# Altium schematic sheet blackfin_f_power.SchDoc: Power
size A3; SheetNumber: 6; SheetTotal: 6
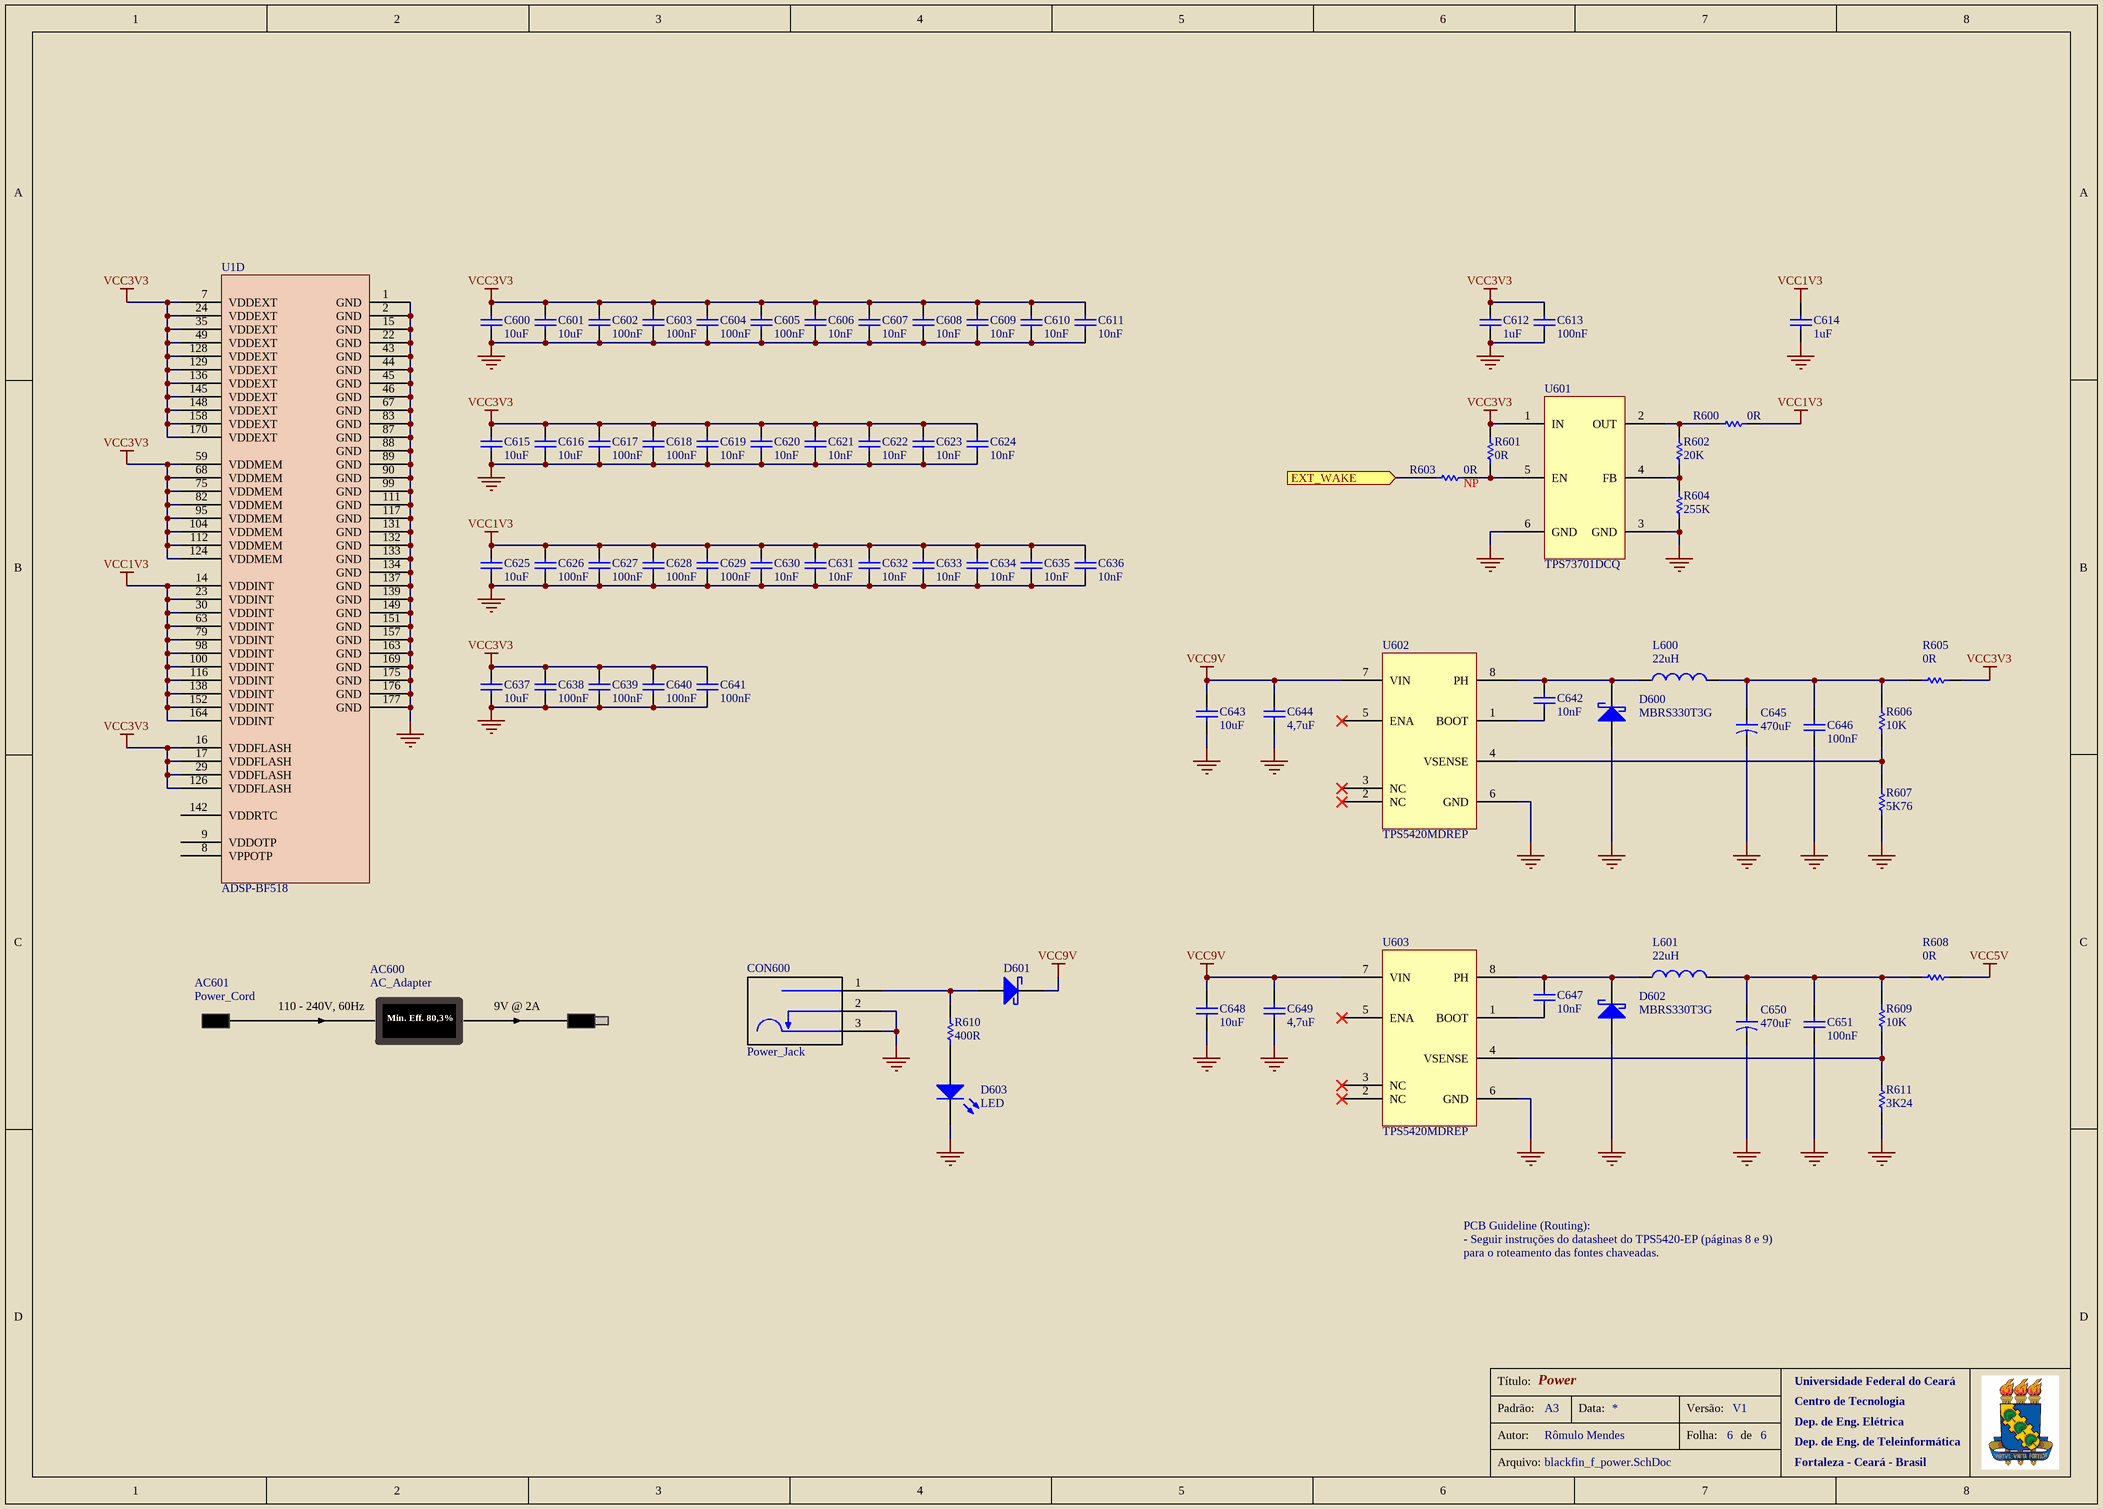
[diagram p0: blackfin_f_power.SchDoc]

## Parts
AC600  AC_Adapter  (mechanical)
AC601  Power_Cord  (mechanical)
C600  10uF  [C_0805]
C601  10uF  [C_0805]
C602  100nF  [C_0603]
C603  100nF  [C_0603]
C604  100nF  [C_0603]
C605  100nF  [C_0603]
C606  10nF  [C_0603]
C607  10nF  [C_0603]
C608  10nF  [C_0603]
C609  10nF  [C_0603]
C610  10nF  [C_0603]
C611  10nF  [C_0603]
C612  1uF  [C_0603]
C613  100nF  [C_0603]
C614  1uF  [C_0603]
C615  10uF  [C_0805]
C616  10uF  [C_0805]
C617  100nF  [C_0603]
C618  100nF  [C_0603]
C619  10nF  [C_0603]
C620  10nF  [C_0603]
C621  10nF  [C_0603]
C622  10nF  [C_0603]
C623  10nF  [C_0603]
C624  10nF  [C_0603]
C625  10uF  [C_0805]
C626  100nF  [C_0603]
C627  100nF  [C_0603]
C628  100nF  [C_0603]
C629  100nF  [C_0603]
C630  10nF  [C_0603]
C631  10nF  [C_0603]
C632  10nF  [C_0603]
C633  10nF  [C_0603]
C634  10nF  [C_0603]
C635  10nF  [C_0603]
C636  10nF  [C_0603]
C637  10uF  [C_0805]
C638  100nF  [C_0603]
C639  100nF  [C_0603]
C640  100nF  [C_0603]
C641  100nF  [C_0603]
C642  10nF  [C_0805]
C643  10uF  [C_0805]
C644  4,7uF  [C_0805]
C645  470uF  [C_Case_Y]
C646  100nF  [C_0603]
C647  10nF  [C_0805]
C648  10uF  [C_0805]
C649  4,7uF  [C_0805]
C650  470uF  [C_Case_Y]
C651  100nF  [C_0603]
CON600  Power_Jack  [Power_Jack]
D600  MBRS330T3G  [Case_430]
D601  Schottky_Diode  [Case_430]  (value not drawn)
D602  MBRS330T3G  [Case_430]
D603  LED  [LED_0603]
L600  22uH  [Inductor_22uH]
L601  22uH  [Inductor_22uH]
R600  0R  [R_0603]
R601  0R  [R_0603]
R602  20K  [R_0603]
R603  0R  [R_0603]
R604  255K  [R_0603]
R605  0R  [R_2512]
R606  10K  [R_0603]
R607  5K76  [R_0603]
R608  0R  [R_2512]
R609  10K  [R_0603]
R610  400R  [R_1206]
R611  3K24  [R_0603]
U1  ADSP-BF518  [LQFP-176]  (part D of 4)
U601  TPS73701DCQ  [SOT-223]
U602  TPS5420MDREP  [SOIC-8 (TPS5420MDREP)]
U603  TPS5420MDREP  [SOIC-8 (TPS5420MDREP)]

## Ports
EXT_WAKE (in)

## Nets
GND: C600.1 C601.1 C602.1 C603.1 C604.1 C605.1 C606.1 C607.1 C608.1 C609.1 C610.1 C611.1 C612.1 C613.1 C614.1 C615.1 C616.1 C617.1 C618.1 C619.1 C620.1 C621.1 C622.1 C623.1 C624.1 C625.1 C626.1 C627.1 C628.1 C629.1 C630.1 C631.1 C632.1 C633.1 C634.1 C635.1 C636.1 C637.1 C638.1 C639.1 C640.1 C641.1 C643.1 C644.1 C645.2 C646.1 C648.1 C649.1 C650.2 C651.1 CON600.2 CON600.3 D600.1(A) D602.1(A) D603.2(K) R604.1 R607.1 R611.1 U1.1(GND) U1.2(GND) U1.15(GND) U1.22(GND) U1.43(GND) U1.44(GND) U1.45(GND) U1.46(GND) U1.67(GND) U1.83(GND) U1.87(GND) U1.88(GND) U1.89(GND) U1.90(GND) U1.99(GND) U1.111(GND) U1.117(GND) U1.131(GND) U1.132(GND) U1.133(GND) U1.134(GND) U1.137(GND) U1.139(GND) U1.149(GND) U1.151(GND) U1.157(GND) U1.163(GND) U1.169(GND) U1.175(GND) U1.176(GND) U1.177(GND) U601.3(GND) U601.6(GND) U602.6(GND) U603.6(GND)
VCC1V3: C614.2 C625.2 C626.2 C627.2 C628.2 C629.2 C630.2 C631.2 C632.2 C633.2 C634.2 C635.2 C636.2 R600.2 U1.14(VDDINT) U1.23(VDDINT) U1.30(VDDINT) U1.63(VDDINT) U1.79(VDDINT) U1.98(VDDINT) U1.100(VDDINT) U1.116(VDDINT) U1.138(VDDINT) U1.152(VDDINT) U1.164(VDDINT)
VCC3V3: C600.2 C601.2 C602.2 C603.2 C604.2 C605.2 C606.2 C607.2 C608.2 C609.2 C610.2 C611.2 C612.2 C613.2 C615.2 C616.2 C617.2 C618.2 C619.2 C620.2 C621.2 C622.2 C623.2 C624.2 C637.2 C638.2 C639.2 C640.2 C641.2 R601.2 R605.2 U1.7(VDDEXT) U1.16(VDDFLASH) U1.17(VDDFLASH) U1.24(VDDEXT) U1.29(VDDFLASH) U1.35(VDDEXT) U1.49(VDDEXT) U1.59(VDDMEM) U1.68(VDDMEM) U1.75(VDDMEM) U1.82(VDDMEM) U1.95(VDDMEM) U1.104(VDDMEM) U1.112(VDDMEM) U1.124(VDDMEM) U1.126(VDDFLASH) U1.128(VDDEXT) U1.129(VDDEXT) U1.136(VDDEXT) U1.145(VDDEXT) U1.148(VDDEXT) U1.158(VDDEXT) U1.170(VDDEXT) U601.1(IN)
VCC5V: R608.2
VCC9V: C643.2 C644.2 C648.2 C649.2 D601.2(K) U602.7(VIN) U603.7(VIN)
EXT_WAKE: R603.1 ; port EXT_WAKE
NetC642_1: C642.1 U602.1(BOOT)
NetC642_2: C642.2 D600.2(K) L600.1 U602.8(PH)
NetC645_1: C645.1 C646.2 L600.2 R605.1 R606.2
NetC647_1: C647.1 U603.1(BOOT)
NetC647_2: C647.2 D602.2(K) L601.1 U603.8(PH)
NetC650_1: C650.1 C651.2 L601.2 R608.1 R609.2
NetCON600_1: CON600.1 D601.1(A) R610.2
NetD603_1: D603.1(A) R610.1
NetR600_1: R600.1 R602.2 U601.2(OUT)
NetR601_1: R601.1 R603.2 U601.5(EN)
NetR602_1: R602.1 R604.2 U601.4(FB)
NetR606_1: R606.1 R607.2 U602.4(VSENSE)
NetR609_1: R609.1 R611.2 U603.4(VSENSE)

Not connected (* = marked no-connect by the designer): U1 8(VPPOTP) 9(VDDOTP) 142(VDDRTC); U602 2(NC)* 3(NC)* 5(ENA)*; U603 2(NC)* 3(NC)* 5(ENA)*

## Notes on the sheet
- (near R603) NP
- PCB Guideline (Routing):
- - Seguir instruções do datasheet do TPS5420-EP (páginas 8 e 9)
- para o roteamento das fontes chaveadas.
- Título:
- Universidade Federal do Ceará
- Padrão:
- Autor:
- A3
- Rômulo Mendes
- Data:
- Versão:
- Folha:
- V1
- de
- Centro de Tecnologia
- Dep. de Eng. Elétrica
- Dep. de Eng. de Teleinformática
- Arquivo:
- Fortaleza - Ceará - Brasil
- (in symbol AC_Adapter) 110 - 240V, 60Hz; 9V @ 2A; Min. Eff. 80,3%

## Library data of the parts
AC600 = AC_Adapter: eVendorPart#: 552-PSA-A18U-090; Part#: PSAA18U-090-R; Manufacturer: Phihong; eVendor: Mouser; eVendorPrice: 17,73; MSRP: 14,27; MOQ: 1000
AC601 = Power_Cord: eVendorPart#: 693-6009.1315; Part#: 6009.1315; Manufacturer: Schurter; eVendor: Mouser; eVendorPrice: 6,74; MSRP: 4,77; MOQ: 1000
C600 C601 C615 C616 C625 C637 = Capacitor: eVendorPart#: 810-C2012Y5V1C106Z; Manufacturer: TDK; Part#: C2012Y5V1C106Z; eVendor: Mouser; eVendorPrice: 0,10; MSRP: 0,05; MOQ: 1000
C602-C605 C613 C617 C618 C626-C629 C638-C641 C646 C651 = Capacitor: eVendorPart#: 81-GRM188R71E104KA01; Manufacturer: Murata; Part#: GRM188R71E104KA01J; eVendor: Mouser; eVendorPrice: 0,14; MSRP: 0,11; MOQ: 1000
C606-C611 C619-C624 C630-C636 = Capacitor: eVendorPart#: 77-VJ0603Y103KXAPBC; Manufacturer: Vishay/Vitramon; Part#: VJ0603Y103KXAPW1BC; eVendor: Mouser; eVendorPrice: 0,05; MSRP: 0,013; MOQ: 1000
C612 C614 = Capacitor: eVendorPart#: 81-GRM188F51E105ZA12; Manufacturer: Murata; Part#: GRM188F51E105ZA12D; eVendor: Mouser; eVendorPrice: 0,07; MSRP: 0,016; MOQ: 1000
C642 C647 = Capacitor: eVendorPart#: 81-GRM216R71H103JA1D; Manufacturer: Murata; Part#: GRM216R71H103JA01D; eVendor: Mouser; eVendorPrice: 0,23; MSRP: 0,026; MOQ: 1000
C643 C648 = Capacitor: eVendorPart#: 810-C2012X5R1C106M; Manufacturer: TDK; Part#: C2012X5R1C106M; eVendor: Mouser; eVendorPrice: 0,16; MSRP: 0,098; MOQ: 1000
C644 C649 = Capacitor: eVendorPart#: 81-GRM21BR61C475KA8L; Manufacturer: Murata; Part#: GRM21BR61C475KA88L; eVendor: Mouser; eVendorPrice: 0,42; MSRP: 0,076; MOQ: 1000
C645 C650 = Capacitor_Pol: eVendorPart#: 80-T520Y477M6ATE15; Part#: T520Y477M006ATE015; Manufacturer: Kemet; eVendor: Mouser; eVendorPrice: 3,27; MSRP: 1,92; MOQ: 1000
CON600 = Power_Jack: eVendorPart#: 163-179PH-EX; Manufacturer: Kobiconn; eVendor: Mouser; MSRP: 0,51; eVendorPrice: 0,87; MOQ: 1000; Part#: 163-179PH-EX
D600 D602 = Schottky_Diode: eVendorPart#: 863-MBRS330T3G; Manufacturer: ON Semiconductor; eVendorPrice: 0,37; MSRP: 0,17; eVendor: Mouser; Part#: MBRS330T3G; MOQ: 1000
D601 = Schottky_Diode: eVendorPart#: 863-MBRS330T3G; Part#: MBRS330T3G; Manufacturer: ON Semiconductor; eVendorPrice: 0,37; MSRP: 0,17; eVendor: Mouser; MOQ: 1000
D603 = LED: Red LED; eVendorPart#: 638-QTLP600C2TR; Manufacturer: Everlight; Part#: QTLP600C2TR; eVendor: Mouser; eVendorPrice: 0,22; MSRP: 0,083; MOQ: 1000
L600 L601 = Inductor: eVendorPart#: 710-744066220; Manufacturer: Wurth Electronics; Part#: 744066220; eVendor: Mouser; eVendorPrice: 2,88; MSRP: 0,95; MOQ: 1000
R600 R601 R603 = Resistor: eVendorPart#: 71-CRCW06030000Z0EB; Part#: CRCW06030000Z0EB; Manufacturer: Vishay/Dale; eVendor: Mouser; eVendorPrice: 0,06; MSRP: 0,015; MOQ: 1000
R602 = Resistor: eVendorPart#: 71-CRCW0603J-20K-E3; Part#: CRCW060320K0JNEA; Manufacturer: Vishay/Dale; eVendor: Mouser; eVendorPrice: 0,06; MSRP: 0,01; MOQ: 1000
R604 = Resistor: eVendorPart#: 71-CRCW0603-255K-E3; Part#: CRCW0603255KFKEA; Manufacturer: Vishay/Dale; eVendor: Mouser; eVendorPrice: 0,06; MSRP: 0,015; MOQ: 1000
R605 R608 = Resistor: eVendorPart#: 71-CRCW2512-0-E3; Part#: CRCW25120000Z0EG; Manufacturer: Vishay/Dale; eVendor: Mouser; eVendorPrice: 0,14; MSRP: 0,05; MOQ: 1000
R606 R609 = Resistor: eVendorPart#: 71-CRCW0603-10K-E3; Part#: CRCW060310K0FKEA; Manufacturer: Vishay/Dale; eVendor: Mouser; eVendorPrice: 0,06; MSRP: 0,015; MOQ: 1000
R607 = Resistor: eVendorPart#: 660-RK73H1JTTDD5761F; Part#: RK73H1JTTDD5761F; Manufacturer: KOA Speer; eVendor: Mouser; eVendorPrice: 0,08; MSRP: 0,015; MOQ: 1000
R610 = Resistor: eVendorPart#: 71-CRCW1206390RJNEB; Part#: CRCW1206390RJNEB; Manufacturer: Vishay/Dale; eVendor: Mouser; eVendorPrice: 0,10; MSRP: 0,02; MOQ: 1000
R611 = Resistor: eVendorPart#: 71-CRCW0603-3.24K-E3; Part#: CRCW06033K24FKEA; Manufacturer: Vishay/Dale; eVendor: Mouser; eVendorPrice: 0,06; MSRP: 0,015; MOQ: 1000
U1 = ADSP-BF518: eVendorPart#: ADSP-BF518BSWZ-4; eVendor: Analog Devices; eVendorPrice: 13,76; MSRP: 13,07; Part#: ADSP-BF518BSWZ-4; Manufacturer: Analog Devices; MOQ: 1000
U601 = TPS73701DCQ: eVendorPart#: 595-TPS73701DCQ; Manufacturer: Texas Instruments; eVendor: Mouser; MSRP: 0,845; eVendorPrice: 1,62; Part#: TPS73701DCQ; MOQ: 1000
U602 U603 = TPS5420MDREP: eVendorPart#: 595-TPS5420MDREP; Manufacturer: Texas Instruments; eVendor: Mouser; eVendorPrice: 5,78; MSRP: 3,61; Part#: TPS5420MDREP; MOQ: 1000